# EasyEDA schematic SCH_ELLIE_BREAKOUTBOARD_ESP32S3.json
TITLE: Sheet_1; REV: 1.0; Date: 2024-03-12; Sheet: 1/1; Drawn By: wouterpennings; Company: Your Company
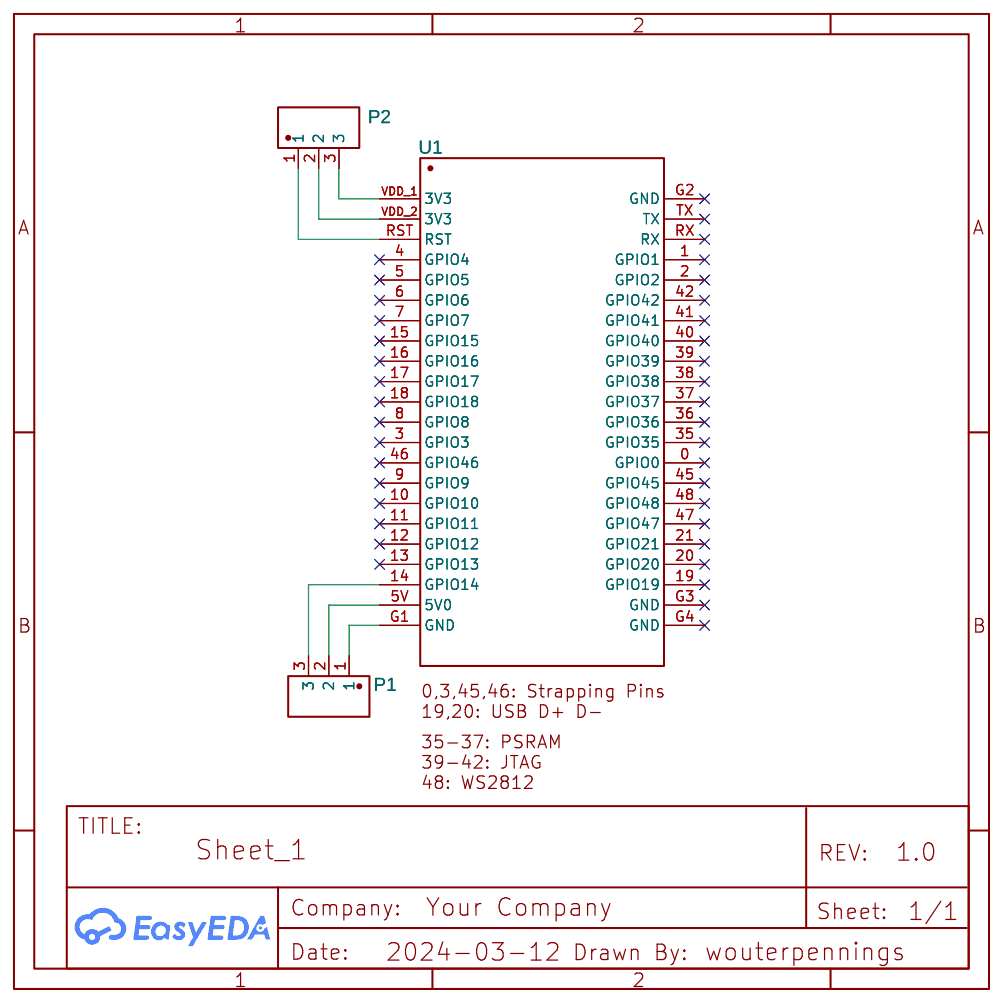
[diagram p0: schematic sheet]

## Parts
P1  DB125-2.54-3P-GN  [CONN-TH_DB125-2.54-3P-GN]
P2  DB125-2.54-3P-GN  [CONN-TH_DB125-2.54-3P-GN]
U1  ESP32-S3-DEVKITC-MINI  [ESP32S3-DEVKIT-C1-V10]

## Library data of the parts
P1 P2 = DB125-2.54-3P-GN: Contributor: LCSC; Supplier: LCSC; Supplier Part: C918121; Manufacturer: DORABO(地博电气); Manufacturer Part: DB125-2.54-3P-GN-S; JLCPCB Part Class: Extended Part
U1 = ESP32-S3-DEVKITC-MINI: Contributor: KevinLai

## Nets
Net-(P1-1): P1.1 U1.G1(GND)
Net-(P1-2): P1.2 U1.5V(5V0)
Net-(P1-3): P1.3 U1.14(GPIO14)
Net-(P2-1): P2.1 U1.RST
Net-(P2-2): P2.2 U1.VDD_2(3V3)
Net-(P2-3): P2.3 U1.VDD_1(3V3)

Not connected (* = marked no-connect by the designer): U1 0(GPIO0)* 1(GPIO1)* 2(GPIO2)* 3(GPIO3)* 4(GPIO4)* 5(GPIO5)* 6(GPIO6)* 7(GPIO7)* 8(GPIO8)* 9(GPIO9)* 10(GPIO10)* 11(GPIO11)* 12(GPIO12)* 13(GPIO13)* 15(GPIO15)* 16(GPIO16)* 17(GPIO17)* 18(GPIO18)* 19(GPIO19)* 20(GPIO20)* 21(GPIO21)* 35(GPIO35)* 36(GPIO36)* 37(GPIO37)* 38(GPIO38)* 39(GPIO39)* 40(GPIO40)* 41(GPIO41)* 42(GPIO42)* 45(GPIO45)* 46(GPIO46)* 47(GPIO47)* 48(GPIO48)* G2(GND)* G3(GND)* G4(GND)* RX* TX*
